# Altium project FSAEWheelDaughterboard.PrjPcb
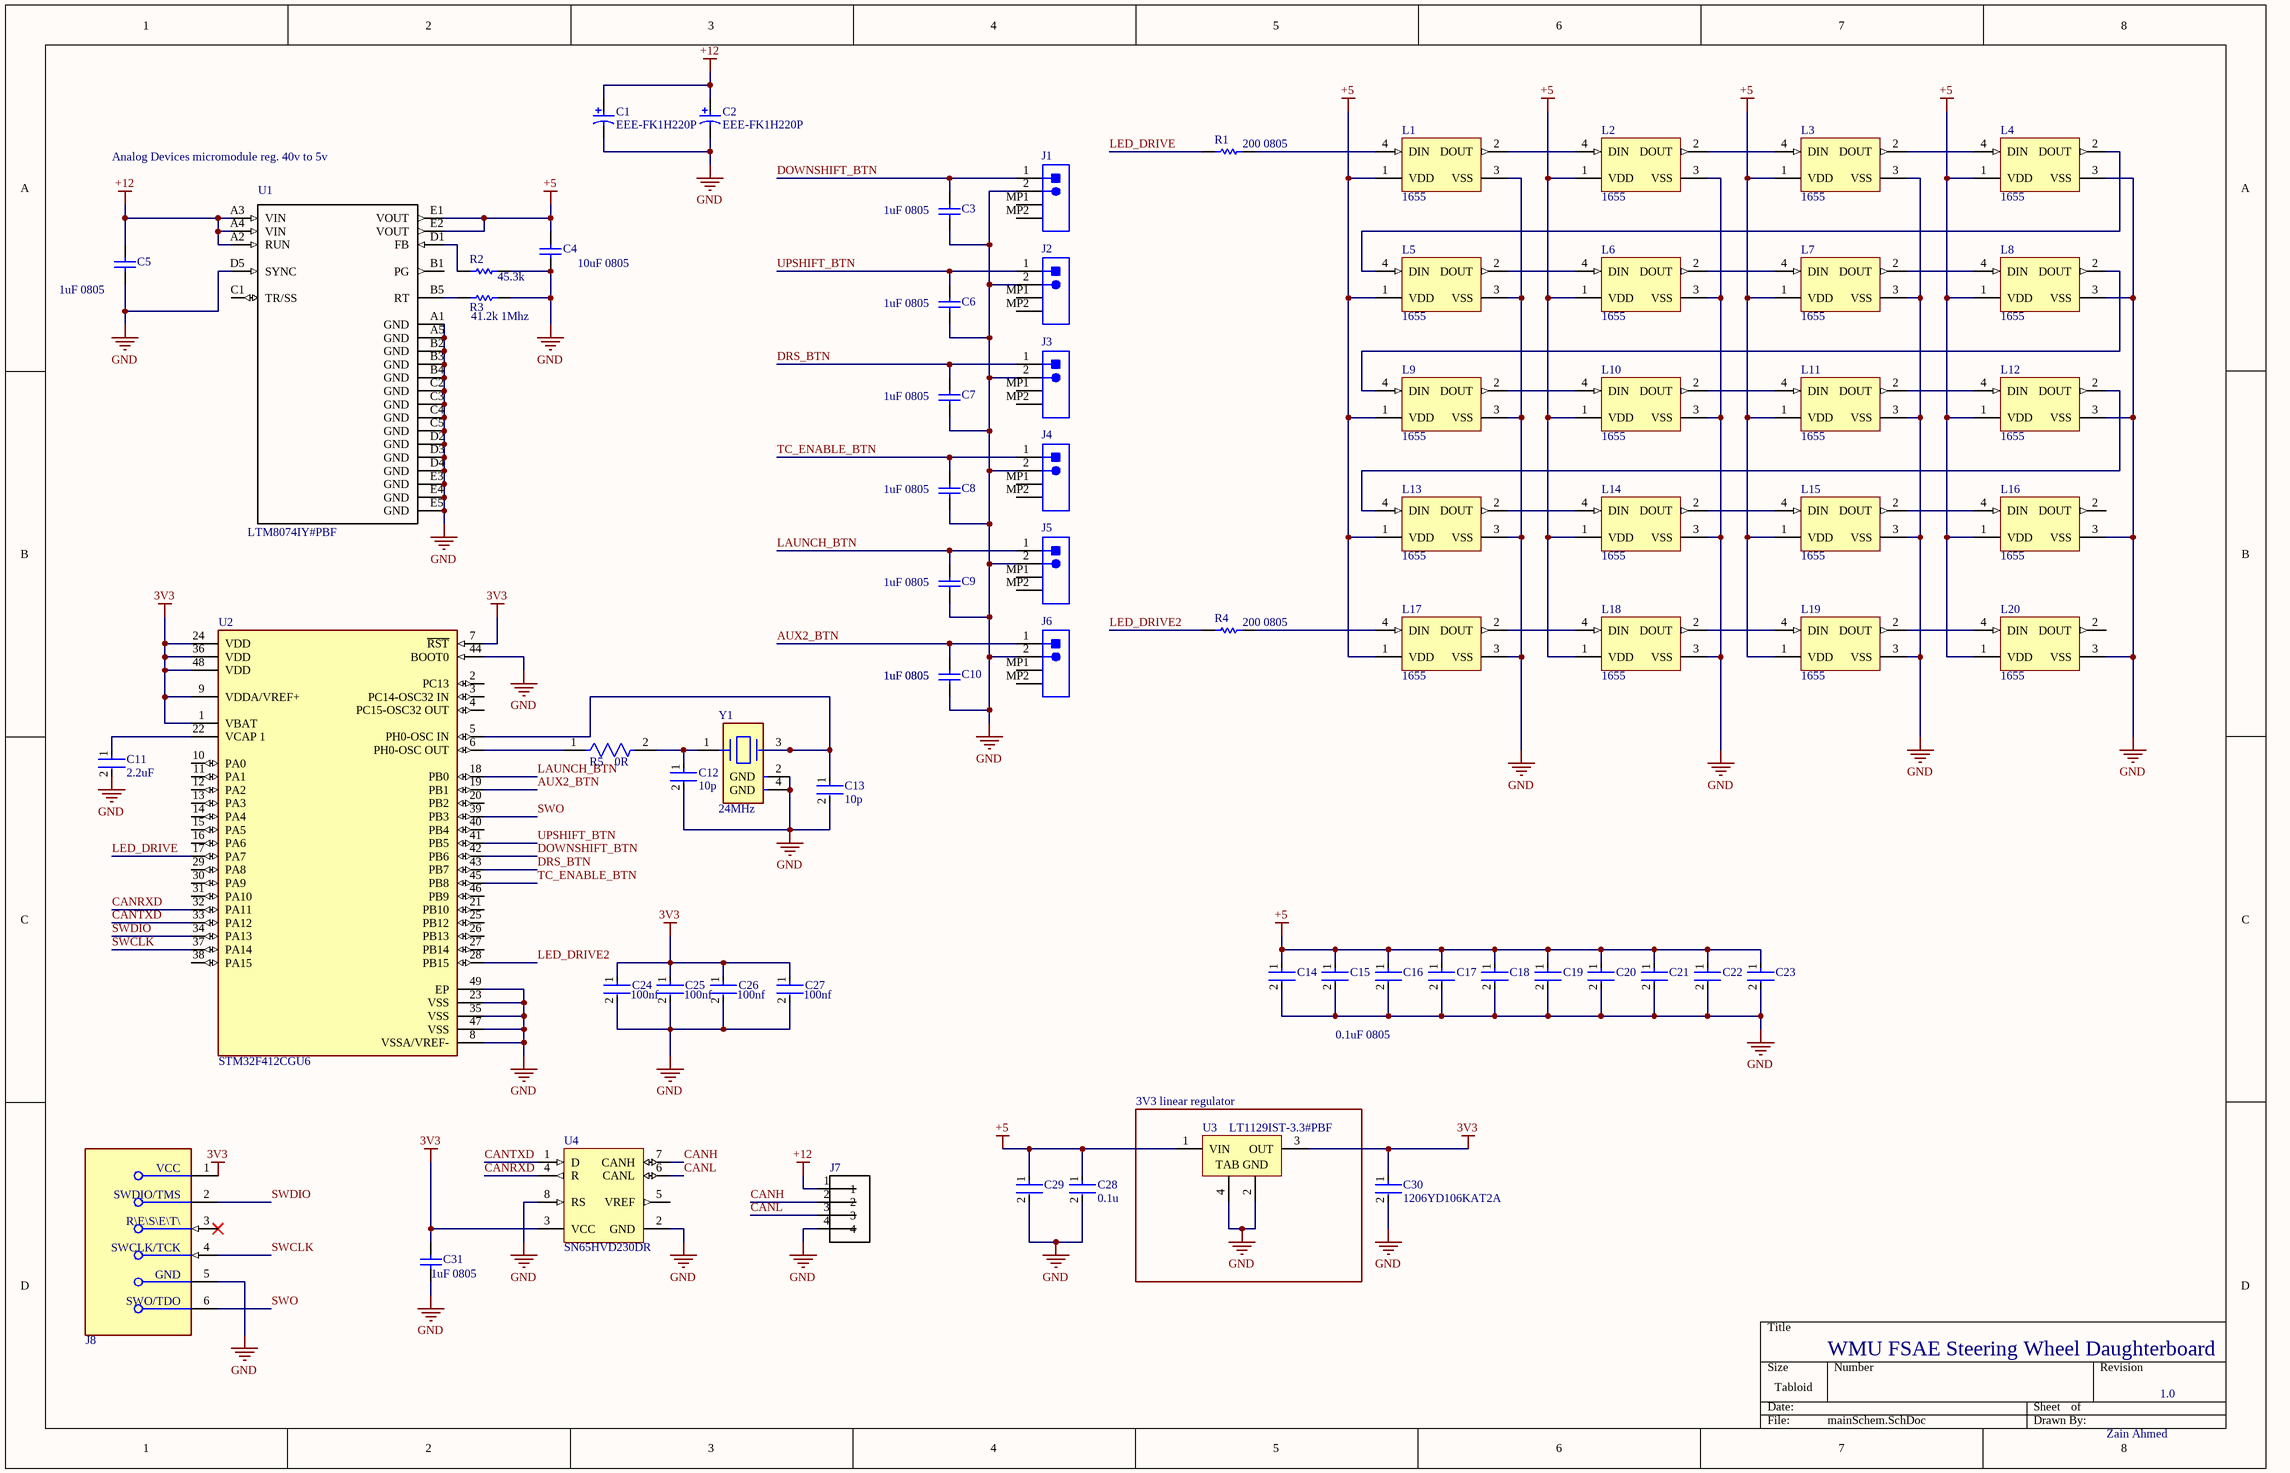
[diagram p0: mainSchem.SchDoc]
1 sheet, 69 parts. Net scope: global (net labels, ports and power ports of the same name join across sheets).
Board file: mainPCB.PcbDoc

## Sheet mainSchem.SchDoc
size Tabloid

### Parts
C1  EEE-FK1H220P  [PNSC-EEE-FK1H220P_L]
C2  EEE-FK1H220P  [PNSC-EEE-FK1H220P_L]
C3  GRM216R61E105KA12D  [CAPC2013X70X45NL10T25]  (value not drawn)
C4  GRM21BR61C106KE15L  [CAPC2013X135X50LL10T20]  (value not drawn)
C5  GRM216R61E105KA12D  [CAPC2013X70X45NL10T25]  (value not drawn)
C6  GRM216R61E105KA12D  [CAPC2013X70X45NL10T25]  (value not drawn)
C7  GRM216R61E105KA12D  [CAPC2013X70X45NL10T25]  (value not drawn)
C8  GRM216R61E105KA12D  [CAPC2013X70X45NL10T25]  (value not drawn)
C9  GRM216R61E105KA12D  [CAPC2013X70X45NL10T25]  (value not drawn)
C10  GRM216R61E105KA12D  [CAPC2013X70X45NL10T25]  (value not drawn)
C11  2.2uF  [FP-GRM188-0_1-e0_2_0_5-MFG]
C12  10p  [FP-0603-L_1_6_0_15-W_0_81-IPC_C]
C13  10p  [FP-0603-L_1_6_0_15-W_0_81-IPC_C]
C14  C0805C104K5RACTU  [FP-C0805C-DN-MFG]  (value not drawn)
C15  C0805C104K5RACTU  [FP-C0805C-DN-MFG]  (value not drawn)
C16  C0805C104K5RACTU  [FP-C0805C-DN-MFG]  (value not drawn)
C17  C0805C104K5RACTU  [FP-C0805C-DN-MFG]  (value not drawn)
C18  C0805C104K5RACTU  [FP-C0805C-DN-MFG]  (value not drawn)
C19  C0805C104K5RACTU  [FP-C0805C-DN-MFG]  (value not drawn)
C20  C0805C104K5RACTU  [FP-C0805C-DN-MFG]  (value not drawn)
C21  C0805C104K5RACTU  [FP-C0805C-DN-MFG]  (value not drawn)
C22  C0805C104K5RACTU  [FP-C0805C-DN-MFG]  (value not drawn)
C23  C0805C104K5RACTU  [FP-C0805C-DN-MFG]  (value not drawn)
C24  C0402C104K8PACTU  [FP-C0402-BB-MFG]  (value not drawn)
C25  C0402C104K8PACTU  [FP-C0402-BB-MFG]  (value not drawn)
C26  C0402C104K8PACTU  [FP-C0402-BB-MFG]  (value not drawn)
C27  C0402C104K8PACTU  [FP-C0402-BB-MFG]  (value not drawn)
C28  0.1u  [FP-C0603C-CF-MFG]
C29  1206YD106KAT2A  [FP-1206-L_3_2_0_2-W_1_6_0-IPC_B]  (value not drawn)
C30  1206YD106KAT2A  [FP-1206-L_3_2_0_2-W_1_6_0-IPC_B]
C31  GRM216R61E105KA12D  [CAPC2013X70X45NL10T25]  (value not drawn)
J1  B2B-PH-SM4-TB(LF)(SN)  [JST-B2B-PH-SM4-TB-2_V]  (value not drawn)
J2  B2B-PH-SM4-TB(LF)(SN)  [JST-B2B-PH-SM4-TB-2_V]  (value not drawn)
J3  B2B-PH-SM4-TB(LF)(SN)  [JST-B2B-PH-SM4-TB-2_V]  (value not drawn)
J4  B2B-PH-SM4-TB(LF)(SN)  [JST-B2B-PH-SM4-TB-2_V]  (value not drawn)
J5  B2B-PH-SM4-TB(LF)(SN)  [JST-B2B-PH-SM4-TB-2_V]  (value not drawn)
J6  B2B-PH-SM4-TB(LF)(SN)  [JST-B2B-PH-SM4-TB-2_V]  (value not drawn)
J7  B4B-PH-SM4-TB  [*JST_B4B-PH-SM4-TB]  (value not drawn)
J8  TC2030-CTX-NL  [Tag_Connect_0_MFG]  (value not drawn)
L1  1655  [ADA-RGB-1655_V]
L2  1655  [ADA-RGB-1655_V]
L3  1655  [ADA-RGB-1655_V]
L4  1655  [ADA-RGB-1655_V]
L5  1655  [ADA-RGB-1655_V]
L6  1655  [ADA-RGB-1655_V]
L7  1655  [ADA-RGB-1655_V]
L8  1655  [ADA-RGB-1655_V]
L9  1655  [ADA-RGB-1655_V]
L10  1655  [ADA-RGB-1655_V]
L11  1655  [ADA-RGB-1655_V]
L12  1655  [ADA-RGB-1655_V]
L13  1655  [ADA-RGB-1655_V]
L14  1655  [ADA-RGB-1655_V]
L15  1655  [ADA-RGB-1655_V]
L16  1655  [ADA-RGB-1655_V]
L17  1655  [ADA-RGB-1655_V]
L18  1655  [ADA-RGB-1655_V]
L19  1655  [ADA-RGB-1655_V]
L20  1655  [ADA-RGB-1655_V]
R1  ERA6AEB201V  [RESC2013X60X40NL20T25]  (value not drawn)
R2  ERJ-6ENF4532V  [RESC2013X70X40ML20T20]  (value not drawn)
R3  ERJ-6ENF4122V  [RESC2013X70X40LL20T20]  (value not drawn)
R4  ERA6AEB201V  [RESC2013X60X40NL20T25]  (value not drawn)
R5  0R  [FP-RC0603-MFG]
U1  LTM8074IY#PBF  [*BGA25C65P5X5_400X400X198N_LTM8074IY#PBF(Primary)]
U2  STM32F412CGU6  [FP-UFQFPN48-A0B9-MFG]
U3  LT1129IST-3.3#PBF  [LT-ST-3-SOT-223_L]
U4  SN65HVD230DR  [D0008A_L]
Y1  24MHz  [FP-7M-MFG]

### Blocks framed on the sheet
3V3 linear regulator: U3

### Nets
3V3: C24.1 C25.1 C26.1 C27.1 C30.1 C31.1 J8.1(VCC) U2.1(VBAT) U2.7(~{RST}) U2.9(VDDA/VREF+) U2.24(VDD) U2.36(VDD) U2.48(VDD) U3.3(OUT) U4.3(VCC)
+5: C4.1 C14.1 C15.1 C16.1 C17.1 C18.1 C19.1 C20.1 C21.1 C22.1 C23.1 C28.1 C29.1 L1.1(VDD) L2.1(VDD) L3.1(VDD) L4.1(VDD) L5.1(VDD) L6.1(VDD) L7.1(VDD) L8.1(VDD) L9.1(VDD) L10.1(VDD) L11.1(VDD) L12.1(VDD) L13.1(VDD) L14.1(VDD) L15.1(VDD) L16.1(VDD) L17.1(VDD) L18.1(VDD) L19.1(VDD) L20.1(VDD) U1.E1(VOUT) U1.E2(VOUT) U3.1(VIN)
+12: C1.1 C2.1 C5.1 J7.1 U1.A2(RUN) U1.A3(VIN) U1.A4(VIN)
GND: C1.2 C2.2 C3.2 C4.2 C5.2 C6.2 C7.2 C8.2 C9.2 C10.2 C11.2 C12.2 C13.2 C14.2 C15.2 C16.2 C17.2 C18.2 C19.2 C20.2 C21.2 C22.2 C23.2 C24.2 C25.2 C26.2 C27.2 C28.2 C29.2 C30.2 C31.2 J1.2 J2.2 J3.2 J4.2 J5.2 J6.2 J7.4 J8.5(GND) L1.3(VSS) L2.3(VSS) L3.3(VSS) L4.3(VSS) L5.3(VSS) L6.3(VSS) L7.3(VSS) L8.3(VSS) L9.3(VSS) L10.3(VSS) L11.3(VSS) L12.3(VSS) L13.3(VSS) L14.3(VSS) L15.3(VSS) L16.3(VSS) L17.3(VSS) L18.3(VSS) L19.3(VSS) L20.3(VSS) R2.2 R3.2 U1.A1(GND) U1.A5(GND) U1.B2(GND) U1.B3(GND) U1.B4(GND) U1.C2(GND) U1.C3(GND) U1.C4(GND) U1.C5(GND) U1.D2(GND) U1.D3(GND) U1.D4(GND) U1.D5(SYNC) U1.E3(GND) U1.E4(GND) U1.E5(GND) U2.8(VSSA/VREF-) U2.23(VSS) U2.35(VSS) U2.44(BOOT0) U2.47(VSS) U2.49(EP) U3.2(GND) U3.4(TAB) U4.2(GND) U4.8(RS) Y1.2(GND) Y1.4(GND)
AUX2_BTN: C10.1 J6.1 U2.19(PB1)
CANH: J7.2 U4.7(CANH)
CANL: J7.3 U4.6(CANL)
CANRXD: U2.32(PA11) U4.4(R)
CANTXD: U2.33(PA12) U4.1(D)
DOWNSHIFT_BTN: C3.1 J1.1 U2.42(PB6)
DRS_BTN: C7.1 J3.1 U2.43(PB7)
LAUNCH_BTN: C9.1 J5.1 U2.18(PB0)
LED_DRIVE: R1.1 U2.17(PA7)
LED_DRIVE2: R4.1 U2.28(PB15)
SWCLK: J8.4(SWCLK/TCK) U2.37(PA14)
SWDIO: J8.2(SWDIO/TMS) U2.34(PA13)
SWO: J8.6(SWO/TDO) U2.39(PB3)
TC_ENABLE_BTN: C8.1 J4.1 U2.45(PB8)
UPSHIFT_BTN: C6.1 J2.1 U2.41(PB5)
NetC11_1: C11.1 U2.22(VCAP_1)
NetC12_1: C12.1 R5.2 Y1.1
NetC13_1: C13.1 U2.5(PH0-OSC_IN) Y1.3
NetL1_2: L1.2(DOUT) L2.4(DIN)
NetL1_4: L1.4(DIN) R1.2
NetL2_2: L2.2(DOUT) L3.4(DIN)
NetL3_2: L3.2(DOUT) L4.4(DIN)
NetL4_2: L4.2(DOUT) L5.4(DIN)
NetL5_2: L5.2(DOUT) L6.4(DIN)
NetL6_2: L6.2(DOUT) L7.4(DIN)
NetL7_2: L7.2(DOUT) L8.4(DIN)
NetL8_2: L8.2(DOUT) L9.4(DIN)
NetL9_2: L9.2(DOUT) L10.4(DIN)
NetL10_2: L10.2(DOUT) L11.4(DIN)
NetL11_2: L11.2(DOUT) L12.4(DIN)
NetL12_2: L12.2(DOUT) L13.4(DIN)
NetL13_2: L13.2(DOUT) L14.4(DIN)
NetL14_2: L14.2(DOUT) L15.4(DIN)
NetL15_2: L15.2(DOUT) L16.4(DIN)
NetL17_2: L17.2(DOUT) L18.4(DIN)
NetL17_4: L17.4(DIN) R4.2
NetL18_2: L18.2(DOUT) L19.4(DIN)
NetL19_2: L19.2(DOUT) L20.4(DIN)
NetR2_1: R2.1 U1.D1(FB)
NetR3_1: R3.1 U1.B5(RT)
NetR5_1: R5.1 U2.6(PH0-OSC_OUT)

Not connected (* = marked no-connect by the designer): J1 MP1 MP2; J2 MP1 MP2; J3 MP1 MP2; J4 MP1 MP2; J5 MP1 MP2; J6 MP1 MP2; J8 3(~{RESET})*; L16 2(DOUT); L20 2(DOUT); U1 B1(PG) C1(TR/SS); U2 2(PC13) 3(PC14-OSC32_IN) 4(PC15-OSC32_OUT) 10(PA0) 11(PA1) 12(PA2) 13(PA3) 14(PA4) 15(PA5) 16(PA6) 20(PB2) 21(PB10) 25(PB12) 26(PB13) 27(PB14) 29(PA8) 30(PA9) 31(PA10) 38(PA15) 40(PB4) 46(PB9); U4 5(VREF)

### Notes on the sheet
- Analog Devices micromodule reg. 40v to 5v
- (near R1) 200 0805
- (near C3) 1uF 0805
- (near C5) 1uF 0805
- (near R2) 45.3k
- (near C4) 10uF 0805
- (near R3) 41.2k 1Mhz
- (near C6) 1uF 0805
- (near C7) 1uF 0805
- (near C8) 1uF 0805
- (near C9) 1uF 0805
- (near R4) 200 0805
- (near C10) 1uF 0805
- 100nf
- (near C27) 100nf
- 0.1uF 0805
- (near C31) 1uF 0805
- WMU FSAE Steering Wheel Daughterboard
- 1.0
- Zain Ahmed

### Library data of the parts
C1 C2 = CMP-2000-06209-1: Cap Aluminum Lytic, 22 uF, +/- 20%, 6.3 to 100 V, -55 to 105 degC, 2-Pin SMD, RoHS, Tape and Reel; Manufacturer: Panasonic; Capacitance: 22µF; Rated Voltage: 50V; Lifetime@Temperature: 2000Hrs@105°C; Ripple Current: 165mA; Impedance: 0.88O; Type: Can; Operating Temp Range: -55to+105°C; Package Reference: EEE-FK1H220P; Case Size/Dimension: Ø6.3x5.8mm; Manufacturer URL: http://www.panasonic.com/; Datasheet URL: http://www.mouser.com/ds/2/315/ABA0000CE120-68386.pdf; Mounting Technology: SurfaceMount; Datasheet Version: 03/2014; Package Description: 2-Pin Aluminum Electrolytic Capacitor, Base 6.6 x 6.6 mm, Height 6.10 mm; Operating Temp-Max: 105°C; Series: FK
C3 C5-C10 C31 = CMP-2007-00957-1: Manufacturer: Murata; Part Number: GRM216R61E105KA12D
C4 = CMP-2007-03453-1: Manufacturer: Murata; Part Number: GRM21BR61C106KE15L
C11 = CMP-2006-02836-2: Chip Multilayer Ceramic Capacitors for General Purpose, 0603, 2.2uF, X7R, 15%, 10%, 10V; Case Code (Metric): 1608; Height: 0.8mm; Packaging: Cut Tape; Voltage: 10V; Lead Free: Lead Free; Min Operating Temperature: -55°C; Voltage Rating (DC): 10V; Max Operating Temperature: 125°C; Voltage Rating: 10V; Dielectric: X7R; Depth: 0.8mm; Case Code (Imperial): 0603; Termination: SMD/SMT; Case/Package: 0603; Number of Pins: 2; REACH SVHC: No SVHC; Mount: Surface Mount; Width: 0.031inch; Material: Ceramic; Capacitance: 2.2uF; Package Quantity: 1; Weight: 7.1E-05oz; Length: 1.6mm; Thickness: 0.035inch; Tolerance: 10%
C12 C13 = CMP-2006-04216-2: General Purpose Ceramic Capacitor, 0603, 10pF, 10%, NP0, 30ppm/°C, 50V; Dielectric: C0G; Case Code (Imperial): 0603; Tolerance: 10%; Thickness: 0.035inch; Contact Plating: Tin; Termination: SMD/SMT; Case/Package: 0603; Max Operating Temperature: 125°C; Packaging: Tape and Reel; REACH SVHC: No SVHC; Case Code (Metric): 1608; Lead Free: Lead Free; Radiation Hardening: No; Mount: Surface Mount; RoHS Compliant: Yes; Voltage Rating: 50V; Voltage Rating (DC): 50V; Series: -; Construction: Flat; Min Operating Temperature: -55°C; Width: 0.032inch; Voltage: 50V; Number of Pins: 2; Package Quantity: 1; Depth: 0.81mm; Capacitance: 10pF; Length: 1.6mm
C14-C23 = CMP-2007-00279-2: CAP CER 0.1UF 50V X7R 0805; Manufacturer: KEMET; Value: 0.10 μF; Tolerance: 0.1; Temperature Coefficient: 30ppm/°C; Material: Ceramic; Manufacturer Part Number: C0805C104K5RACTU; Device Class L2: Capacitors; Temperature Range Low: -55°C; Voltage Rating: 50 V; Digikey Description: CAP CER 0.1UF 50V X7R 0805; Category: Cap; ComponentLink2Description: Datasheet; Octopart: https://octopart.com/c0805c104k5ractu-kemet-143926; RoHS: TRUE; ComponentLink2URL: https://content.kemet.com/datasheets/KEM_C1003_C0G_SMD.pdf; Temperature Characteristic: X7R; Temperature: -55°C to +125°C; Height: 0.88mm; Temperature Range High: +125°C; Device Class L1: Passive Components; Automotive: No; Lead Free: Yes; Ipc Land Pattern Name: CAPC200125X78; Device Class L3: Ceramic Capacitors; Mouser Description: Cap Ceramic 0.1uF 50V X7R 10% SMD 2.0 x 1.2 mm 125 C Paper T/R; Capacitance: 0.10 μF; Package: C0805C-DN
C24-C27 = CMP-2008-02046-2: CAP CER 0.1UF 10V X5R 0402; Manufacturer: Kemet; Material: Ceramic; Capacitance: 0.10 μF; Temperature Coefficient: 15%; Tolerance: 0.1; Value: 0.10 μF; Package: C0402-BB; Temperature: -55°C to +125°C; ComponentLink2Description: Datasheet; Temperature Characteristic: X5R; Device Class L1: Passive Components; Height: 0.55mm; Lead Free: Yes; ComponentLink2URL: https://content.kemet.com/datasheets/KEM_C1002_X7R_SMD.pdf; Device Class L2: Capacitors; Temperature Range Low: -55°C; Temperature Range High: +125°C; RoHS: TRUE; Octopart: https://octopart.com/c0402c104k8pactu-kemet-140039; Automotive: No; Mouser Description: Capacitor 100 nF 10 VDC 0402; Category: Cap; Voltage Rating: 10 V; Digikey Description: CAP CER 0.1UF 10V X5R 0402; Ipc Land Pattern Name: CAPC10050X50; Device Class L3: Ceramic Capacitors; Manufacturer Part Number: C0402C104K8PACTU
C28 = CMP-2006-03061-2: CAP CER 0.1UF 50V X7R 0603; Manufacturer: KEMET; Manufacturer Part Number: C0603C104K5RACTU; Tolerance: 0.1; Temperature Coefficient: 30ppm/°C; Material: Ceramic; Automotive Grade: Grade 1; Value: 0.10 μF; Temperature: -55°C to +125°C; RoHS: TRUE; Temperature Range High: +125°C; Lead Free: Yes; Octopart: https://octopart.com/c0603c104k5ractu-kemet-139244; Digikey Description: CAP CER 0.1UF 50V X7R 0603; Category: Cap; Package: C0603C-CF; ComponentLink2Description: Datasheet; Temperature Range Low: -55°C; Device Class L1: Passive Components; Voltage Rating: 50 V; Automotive: Yes; Device Class L3: Ceramic Capacitors; ComponentLink2URL: https://api.kemet.com/component-edge/download/datasheet/C0603C100J5GACAUTO.pdf; Capacitance: 0.10 μF; Device Class L2: Capacitors; Temperature Characteristic: X7R; Height: 0.87mm
C29 C30 = CMP-04427-000082-1: General Purpose Ceramic Capacitor, 1206, 10uF, 10%, X5R, 15%, 16V; Max Operating Temperature: 85°C; Tolerance: 10%; Dielectric: X5R; Series: -; Case Code (Imperial): 1206; Width: 1.6mm; Termination: SMD/SMT; Voltage Rating: 16V; REACH SVHC: No SVHC; Length: 3.2mm; Size: 1.78mm; Capacitance: 10uF; Package Quantity: 1; Voltage: 16V; RoHS Compliant: Yes; Thickness: 0.07inch; Mount: Surface Mount; Radiation Hardening: No; Voltage Rating (DC): 16V; Min Operating Temperature: -55°C; Case Code (Metric): 3216; Construction: Flat; Depth: 1.6mm; Height: 0.07mm; Lead Free: Lead Free; Number of Pins: 2; Case/Package: 1206; Packaging: Tape and Reel
J1-J6 = CMP-2000-05163-1: Male Header, Pitch 2 mm, 1 x 2 Position, Height 6.6 mm, RoHS, Tape and Reel; Manufacturer: JST; No of Positions: 2; Style/Orientation: StraightHeader/Plug; Pitch: 2mm; Datasheet URL: https://ciiva.com/datasheet-click-26894756?src=ciiva&sig=90099765; Termination: Crimp; Manufacturer URL: http://www.jst.com/home2.html; Type: ShroudedHeader; Datasheet Version: Dec-12
J7 = B4B-PH-SM4-TB: Connector Header Surface Mount 4 position 0.079 _2.00mm_; MF: JST Sales; SnapEDA_Link: https://www.snapeda.com/parts/B4B-PH-SM4-TB/JST%20Sales%20America%20Inc./view-part/48901/?ref=snap; Availability: Unavailable; Package: None; Price: None; MP: B4B-PH-SM4-TB; Value: *
L1-L20 = CMP-2000-05026-1: Intelligent Control LED Integrated Light Source, 3.5 to 5.3 V, -25 to 80 degC, 4-Pin SMD, RoHS, Tape and Reel; Manufacturer: Adafruit-Industries-LLC; Number of LEDs: 10; Configuration: Discrete; Utilized LED: WS2812(5050); Color: Red,Green,Blue(RGB); Datasheet URL: http://datasheet.octopart.com/ADA1655-Adafruit-Industries-datasheet-32028139.pdf; Series: Neopixel; Interface: -; Package Description: 4-Pin Surface Mount Device, Body 5 x 5 mm; Category: Optoelectronics; Controller Type: -; Package Reference: 1655; Manufacturer URL: https://www.adafruit.com/; Mounting Type: SurfaceMount; Datasheet Version: May-13; Size / Dimension: 5.00mmLx5.00mmW; Family: Addressable,Specialty
R1 R4 = CMP-2001-00608-1: Manufacturer: Panasonic; Part Number: ERA6AEB201V
R2 = CMP-2001-00193-1: Manufacturer: Panasonic; Part Number: ERJ-6ENF4532V
R3 = CMP-2001-00174-1: Manufacturer: Panasonic; Part Number: ERJ-6ENF4122V
R5 = CMP-2000-06925-2: RES SMD 0 OHM JUMPER 1/10W 0603; Manufacturer: Yageo; Manufacturer Part Number: RC0603FR-070RL; Tolerance: 1%; Value: 0Ω; Power Rating: 0.1W; Voltage Rating: 75V; Composition: Thick Film; Temperature Range Low: -55°C; Ipc Land Pattern Name: RESC16080X45; Lead Free: Yes; Digikey Description: RES SMD 0 OHM JUMPER 1/10W 0603; Height: 0.55mm; Automotive: No; Device Class L3: Chip SMD Resistors; Device Class L1: Passive Components; Device Class L2: Resistors; Footprint Url: http://www.yageo.com/exep/pages/download/literatures/PYu-R_Mount_10.pdf; Category: Res; Mouser Description: RC Series 0603 0.1 W 0 O Jumper Surface Mount Thick Film Chip Resistor; Resistance: 0Ω; ComponentLink2URL: http://www.yageo.com/documents/recent/PYu-RC_Group_51_RoHS_L_10.pdf; Series: RC_L; ComponentLink2Description: Datasheet; RoHS: TRUE; Temperature: -55°C to +155°C; Temperature Range High: +155°C; Package: RC0603; Octopart: https://octopart.com/rc0603fr-070rl-yageo-1180803
U1 = LTM8074IY#PBF: 40Vin, 0.7A Step Dwn uModule Reg; MF: Analog Devices; SnapEDA_Link: https://www.snapeda.com/parts/LTM8074IY%23PBF/Analog%20Devices/view-part/4335081/?ref=snap; Availability: Unavailable; Package: BGA -25 Analog Devices; Price: None; MP: LTM8074IY#PBF; Value: *
U2 = CMP-12105-000086-1: IC MCU 32BIT 1MB FLASH 48UFQFPN; Frequency: 100MHz; Peripherals: Brown-out Detect/Reset; Number of I/Os: 36; Interface: I2C; Core Architecture: ARM; Oscillator Type: Internal; Memory Type: FLASH; Memory Size: 1MB; Min Operating Temperature: -40°C; Max Operating Temperature: 85°C
U3 = CMP-0476-01834-1: Micropower Low Dropout Regulator with Shutdown, 4.15 to 30 V Vin, 3.3 V Vout, 3-pin SOT223 (ST-3), -40 to 125 degC, Pb-Free; Manufacturer: Linear Technology; Vin Min(V): 4.15; Iout(mA): 700; Number of Outputs: 1; Vin Max(V): 30; Dropout Voltage(V): 0.45; PSRR(dB): 64; Discrete Pass Element: no; Shutdown Current(uA): 16; Output Voltage: 3.3 V; Isupply(mA): 0.05; RoHS: TRUE; PartNumber: LT1129IST-3.3#PBF; ComponentLink3URL: http://cds.linear.com/docs/en/packaging/SOT_3_05-08-1630.pdf; PackageReference: ST-3; ComponentLink3Description: Package Specification; PackageDescription: 3-Pin Plastic SOT-223, 3.505 x 6.505 mm Body, Pitch 2.3 mm; Mounting Technology: Surface Mount; DatasheetVersion: Rev. F; ComponentLink2URL: http://cds.linear.com/docs/en/datasheet/112935ff.pdf; ComponentLink1URL: http://www.linear.com/; PackageVersion: Jun-10; ComponentLink2Description: Datasheet; ComponentLink1Description: Manufacturer URL
U4 = CMP-0315-00015-2: 3.3V CAN Transceiver with Standby Mode, 17 mA, -40 to 85 degC, 8-pin SOIC (D), Green (RoHS & no Sb/Br); Manufacturer: Texas Instruments; Rating: Catalog; Transient Pulse Protection(V): -25 to 25; Receivers Per Package: 1; ICC(Max)(mA): 17; Supply Voltage(s)(V): 3.3; Low Power Mode: Standby; Mounting Technology: Surface Mount; PackageReference: D0008A; Footprint: PCA82C250; ComponentLink1URL: http://www.ti.com/general/docs/lit/getliterature.tsp?genericPartNumber=SN65HVD230&fileType=pdf; Code_JEDEC: MS-012AA; ComponentLink1Description: Datasheet; Eco-Plan: Green (RoHS & no Sb/Br); PartNumber: SN65HVD230DR; PackageDescription: 8-Pin Plastic Small Outline Integrated Circuit, 4.9 x 3.9 mm, Pitch 1.27 mm Pitch; Isolated: No; DatasheetVersion: SLOS346K; PackageVersion: revM, Jun-2011; SubFamily: CAN; Drivers Per Package: 1
Y1 = CMP-18717-000318-1: Crystal 24MHz, 10ppm, 10pF, 50Ω; ESR (Equivalent Series Resistance): 60R; Lead Free: Lead Free; Packaging: Tape and Reel; Length: 3.2mm; Frequency: 24MHz; Load Capacitance: 10pF; REACH SVHC: No SVHC; Width: 0.098inch; Height: 0.031inch; Tolerance: 10ppm; Frequency Stability: 10ppm; Min Operating Temperature: -20°C; Max Operating Temperature: 70°C; Frequency Tolerance: 10ppm; Number of Pins: 4; Mount: Surface Mount; Termination: SMD/SMT; Case/Package: SMD/SMT; Package Quantity: 3000; Depth: 2.5mm; Series: 7M